# Altium schematic sheet MCU GPIO.SchDoc
size 297 x 209 mm; SheetNumber: 20; SheetTotal: 29
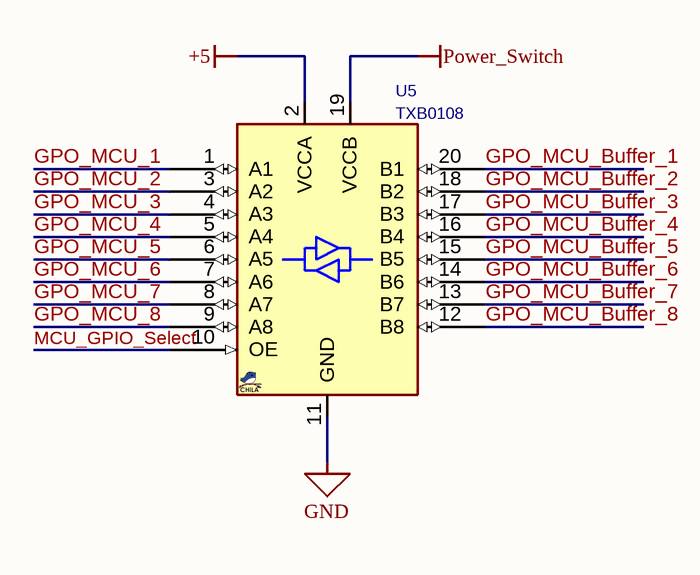
[diagram p0: MCU GPIO.SchDoc]

## Parts
U5  TXB0108  [SOG65_20]

## Nets
+5: U5.2(VCCA)
GND: U5.11(GND)
Power_Switch: U5.19(VCCB)
GPO_MCU_1: U5.1(A1)
GPO_MCU_2: U5.3(A2)
GPO_MCU_3: U5.4(A3)
GPO_MCU_4: U5.5(A4)
GPO_MCU_5: U5.6(A5)
GPO_MCU_6: U5.7(A6)
GPO_MCU_7: U5.8(A7)
GPO_MCU_8: U5.9(A8)
GPO_MCU_Buffer_1: U5.20(B1)
GPO_MCU_Buffer_2: U5.18(B2)
GPO_MCU_Buffer_3: U5.17(B3)
GPO_MCU_Buffer_4: U5.16(B4)
GPO_MCU_Buffer_5: U5.15(B5)
GPO_MCU_Buffer_6: U5.14(B6)
GPO_MCU_Buffer_7: U5.13(B7)
GPO_MCU_Buffer_8: U5.12(B8)
MCU_GPIO_Select: U5.10(OE)

## Notes on the sheet
- Drawn
- Name
- Date
- Drawing Title
- Checked
- Drawing No.
- Approved
- Size
- A4
- Ver.
- Rev.
- Sheet
- Of

## Library data of the parts
U5 = TXB0108_TSSOP20: Buffer, VOLTAGE-LEVEL TRANSLATOR, 8-BIT, BIDIRECTIONAL, AUTO-DIRECTION SENSING; MANF: Texas Instruments; DESC: 50mA; MANF_P#: TXB0108PWR; PARAM2: 1.2~3.6VCCA, 1.65~5.5V VCCB (VCCA <= VCCB); PARAM: 8-BIT, BIDIRECTIONAL, AUTO-DIRECTION SENSING; VALUE: TXB0108